# EAGLE design RGBchipLED_dip-borad (EAGLE 9.4.2)
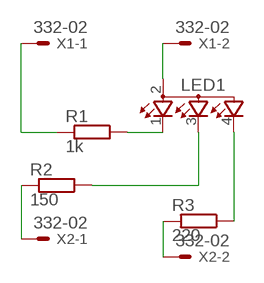
[diagram p0: schematic, sheet 1]

## Parts
LED1  TOPLED-3  [P-LCC-4-3]
R1  1k  SMK  [SMK]
R2  150  SMK  [SMK]
R3  220  SMK  [SMK]
X1  332-02  [332-02]
X2  332-02  [332-02]

## Nets
N$1: R1.2 X1.1
N$2: LED1.2(A2) X1.2
N$3: R2.2 X2.1
N$4: LED1.4(CGREEN) R3.1
N$5: LED1.3(CBLUE) R2.1
N$6: R3.2 X2.2
N$7: LED1.1(CRED) R1.1

## Library data of the parts
LED1 = led:TOPLED-3: OSRAM - Hyper Multi TOPLED® (RGB) LB E673, LV E673, LT E673 - Power TOPLED® Enhanced optical Power LED (HOP2000) LS E67B, LA E67B, LO E67B, LY E67B - Hyper Multi TOPLED® Enhanced optical Power LED (HOP2000 / ATON®) LATB T66B - Hyper Multi TOPLED® Hyper-Bright LED LATB T686 Source: http://www.osram.convergy.de/
R1-R3 = resistor-shunt:SMK: SMD SHUNT RESISTOR; OC_FARNELL: unknown; OC_NEWARK: unknown
X1 X2 = con-garry:332-02: 2 Pin - 2mm Dual Row Source: www.mpe-connector.de / garry_shortform_2012.pdf

## Net classes
0 default: width 0.61 mm, clearance 0.508 mm

## Board
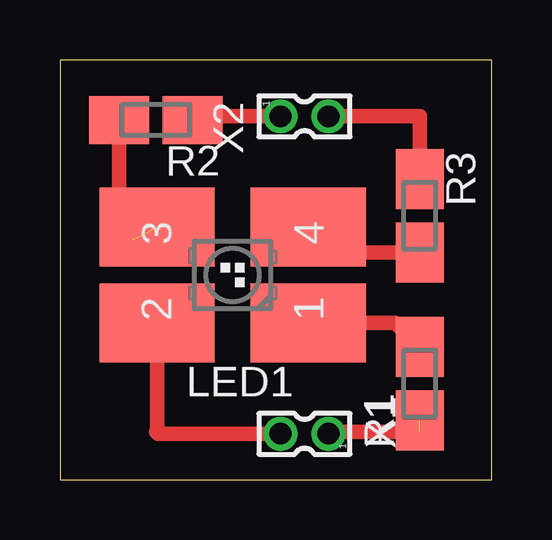
[diagram p1: board, top side]

Size 18 x 17.5 mm. Coordinates in mm from the lower left corner, seen from the top.
Outline: 0,0 18,0 18,17.5 0,17.5 0,0
Copper layers (1*16): Top 0.035mm / dielectric 1.5mm / Bottom 0.035mm
Design rules "default": minimum track width 6mil, minimum drill 0.35mm, track to track 6mil, track to pad 6mil, pad to pad 6mil, via to via 6mil, smd to smd 6mil, copper to edge 40mil, drill to drill 6mil, minimum pad ring 10mil, minimum via ring 8mil, stop-mask expansion 4mil, vias tented up to drill 0mil, thermal gap 10mil

### Footprints (pad centres in the part's own frame; a part is rotated, then mirrored left to right if it is on the bottom)
P-LCC-4-3 = smd 3.3 x 4.8: 1 -2,-3.15; 2 -2,3.15; 3 2,3.15; 4 2,-3.15
SMK = smd 2.5 x 2: 1 1.524,0; 2 -1.524,0
332-02 = drill 0.9 pad 1.27: 1 0,-1; 2 0,1

### Placement (x,y rotation side)
LED1  7.2,8.53 90 top
R1  15,4 90 top
R2  4,15 180 top
R3  15,11 270 top
X1  10.2,1.91 90 top
X2  10.2,15.15 270 top

### Tracks (layer width: path | path; a pad name or v marks a point on that pad's centre or on a via)
N$1  (1 unrouted)
  Top 0.61: X1.1 11.29,2 15,2
N$2
  Top 0.61: LED1.2 4.05,2.05 4,2 4.09,1.91 X1.2
N$3
  Top 0.61: R2.2 5.67,15.15 X2.1
N$4
  Top 0.61: R3.1 11.4,9.48 LED1.4
N$5  (1 unrouted)
  Top 0.61: R2.1 2.48,10.52 3,10
N$6
  Top 0.61: X2.2 15,15.15 R3.2
N$7
  Top 0.61: LED1.1 13.99,6.53 R1.1